# Altium schematic sheet Power SUM.SchDoc
size A4; Organization: Altium Limited; Address1: L3, 12a Rodborough Rd; Address2: Frenchs Forest; Address3: NSW; Address4: Australia 2086
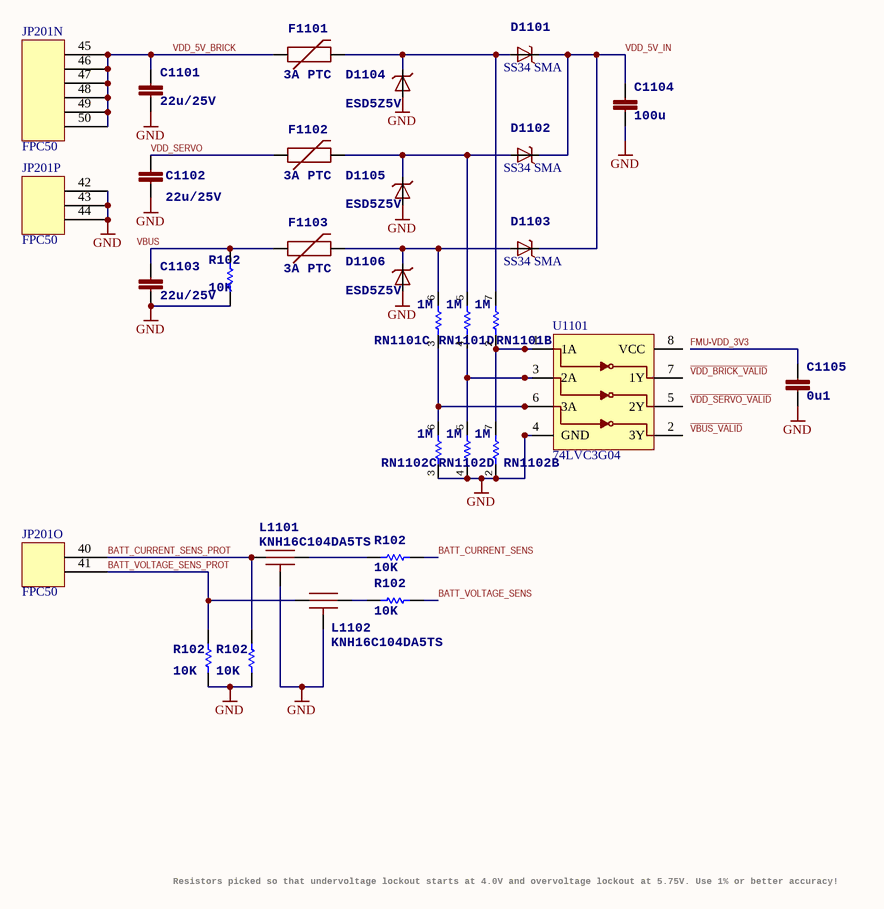
[diagram p0: Power SUM.SchDoc]

## Parts
C1101  >NAME: C1101  [0805-CAP]  (hidden comment: 22u/25V)
C1102  >NAME: C1102  [0805-CAP]  (hidden comment: 22u/25V)
C1103  >NAME: C1103  [0805-CAP]  (hidden comment: 22u/25V)
C1104  >NAME: C1104  [1206-CAP]  (hidden comment: 100u)
C1105  >NAME: C1105  [0603-CAP]  (hidden comment: 0u1)
D1101  SS34 SMA  [SMA]
D1102  SS34 SMA  [SMA]
D1103  SS34 SMA  [SMA]
D1104  ESD5Z5V  [SOD523]
D1105  ESD5Z5V  [SOD523]
D1106  ESD5Z5V  [SOD523]
F1101  >NAME: F1101  [PTC-1206]  (hidden comment: 3A PTC)
F1102  >NAME: F1102  [PTC-1206]  (hidden comment: 3A PTC)
F1103  >NAME: F1103  [PTC-1206]  (hidden comment: 3A PTC)
JP201  FPC50  [FPC-0.5-50下接带锁]  (parts N,O,P of 16)
L1101  KNH16C104DA5TS  [KYOCERA-KNH16-DA]
L1102  KNH16C104DA5TS  [KYOCERA-KNH16-DA]
R1101  >NAME: R102  [0603-RES]  (hidden comment: 10K)
R1102  >NAME: R102  [0603-RES]  (hidden comment: 10K)
R1103  >NAME: R102  [0603-RES]  (hidden comment: 10K)
R1104  >NAME: R102  [0603-RES]  (hidden comment: 10K)
R1105  >NAME: R102  [0603-RES]  (hidden comment: 10K)
RN1101  1M  [EXB28V]  (parts B,C,D of 4)
RN1102  1M  [EXB28V]  (parts B,C,D of 4)
U1101  74LVC3G04  [TSSOP8_SOT505-2]

## Nets
GND: C1101.P$2 C1102.P$2 C1103.P$2 C1104.P$2 C1105.P$2 D1104.A D1105.A D1106.A JP201.42 JP201.43 JP201.44 L1101.P$3_P$4_P$5 L1102.P$3_P$4_P$5 R1103.P$2 R1104.P$2 R1105.P$2 RN1102.2 RN1102.3 RN1102.4 U1101.4(GND)
BATT_CURRENT_SENS: R1101.P$1
BATT_CURRENT_SENS_PROT: JP201.40 L1101.P$1 R1104.P$1
BATT_VOLTAGE_SENS: R1102.P$1
BATT_VOLTAGE_SENS_PROT: JP201.41 L1102.P$1 R1103.P$1
FMU-VDD_3V3: C1105.P$1
VDD_5V_BRICK: C1101.P$1 F1101.1 JP201.45 JP201.46 JP201.47 JP201.48 JP201.49 JP201.50
VDD_5V_IN: C1104.P$1 D1101.C D1102.C D1103.C
VDD_SERVO: C1102.P$1 F1102.1
NetC1103_P$1: C1103.P$1 F1103.1 R1105.P$1
NetD1101_A: D1101.A D1104.C F1101.2 RN1101.7
NetD1102_A: D1102.A D1105.C F1102.2 RN1101.5
NetD1103_A: D1103.A D1106.C F1103.2 RN1101.6
NetL1101_P$2: L1101.P$2 R1101.P$2
NetL1102_P$2: L1102.P$2 R1102.P$2
NetRN1101_2: RN1101.2 RN1102.7 U1101.1(1A)
NetRN1101_3: RN1101.3 RN1102.6 U1101.6(3A)
NetRN1101_4: RN1101.4 RN1102.5 U1101.3(2A)

Not connected (* = marked no-connect by the designer): U1101 2(3Y) 5(2Y) 7(1Y) 8(VCC)

## Notes on the sheet
- Resistors picked so that undervoltage lockout starts at 4.0V
  and overvoltage lockout at 5.75V.
  Use 1% or better accuracy!
- Labels drawn without touching a wire or pin: VBUS, ~{VBUS_VALID}, ~{VDD_BRICK_VALID}, ~{VDD_SERVO_VALID}
- Title
- Size:
- Date:
- A4
- Number:
- Time:
- Revision:
- Sheet
- of
- File:

## Library data of the parts
C1101-C1103 = CAP0805: <b>Capacitor</b> / Standard 0603 ceramic capacitor, and 0.1" leaded capacitor.; PARTNO: CL21A226MAQNNNE; >VALUE: 22u/25V
C1104 = CAP1206: <b>Capacitor</b> / Standard 0603 ceramic capacitor, and 0.1" leaded capacitor.; PARTNO: C3216X5R1A107M160AC; >VALUE: 100u
C1105 = CAP0402: <b>Capacitor</b> / Standard 0603 ceramic capacitor, and 0.1" leaded capacitor.; PARTNO: CC0402ZRY5V7BB104; >VALUE: 0u1
D1101-D1103 = DIODE-SCHOTTKY_MSMP: Schottky barrier diode in DO214AC, e.g. Fairchild SS14.
D1104-D1106 = DIODE-TVS
F1101-F1103 = PTCSMD: <b>Resettable Fuse PTC</b> / Resettable Fuse. Spark Fun Electronics SKU : COM-08357; PARTNO: 3A PTC; >VALUE: 3A PTC
L1101 L1102 = KNH16C104DA5TS: Kyocera KNH16C104DA5TS EMI filter
R1101-R1105 = RESISTOR0402-RES: <b>Resistor</b> / Basic schematic elements and footprints for 0603, 1206, and PTH 1/10th watt (small) resistors.; PARTNO: RC0402FR-0710KL; >VALUE: 10K
RN1101 RN1102 = 4R-NEXB28V: <b>Array Chip Resistor</b><p> / Source: RS Component / Phycomp; PARTNO: EXB-28V105JX; OC_FARNELL: unknown; OC_NEWARK: unknown